# Altium schematic sheet CTR_USB.SchDoc: USB
size A4; DrawnBy: Andrei Divinagracia; Revision: 0A; SheetNumber: 9; SheetTotal: 10
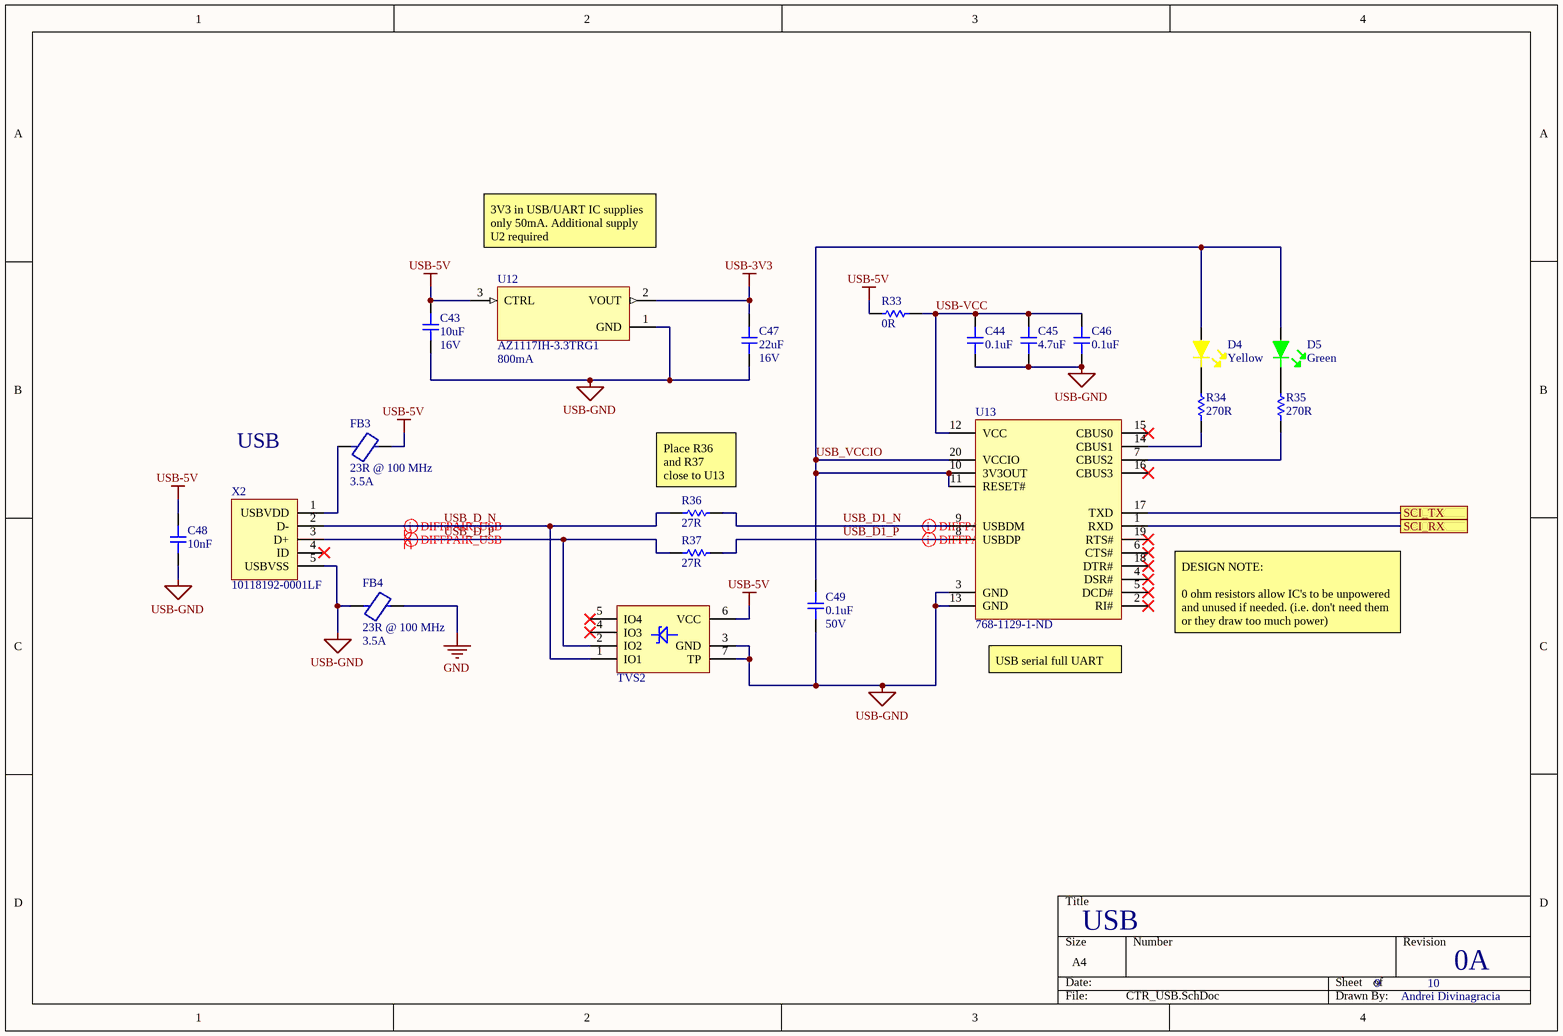
[diagram p0: CTR_USB.SchDoc]

## Parts
C43  10uF  Voltage: 16V  [CAP-0805]
C44  0.1uF  [CAP-0805]
C45  4.7uF  [CAP-1206]
C46  0.1uF  [CAP-0805]
C47  22uF  Voltage Rating: 16V  [CAP-0805]
C48  10nF  [CAP-0805]
C49  0.1uF  Voltage Rating: 50V  [CAP-0603]
D4  Yellow  [LED-0603]
D5  Green  [LED-0603]
FB3  23R @ 100 MHz  Max Current Rating: 3.5A  [FB-1806]
FB4  23R @ 100 MHz  Max Current Rating: 3.5A  [FB-1806]
R33  0R  [RES-0603]
R34  270R  [RES-0603]
R35  270R  [RES-0603]
R36  27R  [RES-0603]
R37  27R  [RES-0603]
TVS2  TVS-4-5.5V-Bi  [TVS-DRS-TP-5]  (value not drawn)
U12  AZ1117IH-3.3TRG1  Output Current: 800mA  [SOT223]
U13  768-1129-1-ND  [SSOP-20]
X2  10118192-0001LF  [USB_MICRO]

## Ports
SCI_RX, SCI_TX

## Nets
GND: FB4.2
USB-3V3: C47.2 U12.2(VOUT)
USB-5V: C43.2 C48.1 FB3.2 R33.2 TVS2.6(VCC) U12.3(CTRL)
USB-GND: C43.1 C44.1 C45.1 C46.1 C47.1 C48.2 C49.1 FB4.1 TVS2.3(GND) TVS2.7(TP) U12.1(GND) U13.3(GND) U13.13(GND) X2.5(USBVSS)
SCI_RX: U13.1(RXD) ; port SCI_RX
SCI_TX: U13.17(TXD) ; port SCI_TX
USB-VCC: C44.2 C45.2 C46.2 R33.1 U13.12(VCC)
USB_D1_N: R36.2 U13.9(USBDM)
USB_D1_P: R37.2 U13.8(USBDP)
USB_D_N: R36.1 TVS2.1(IO1) X2.2(D-)
USB_D_P: R37.1 TVS2.2(IO2) X2.3(D+)
USB_VCCIO: C49.2 D4.1 D5.1 U13.10(3V3OUT) U13.11(RESET#) U13.20(VCCIO)
NetD4_2: D4.2 R34.2
NetD5_2: D5.2 R35.2
NetFB3_1: FB3.1 X2.1(USBVDD)
NetR34_1: R34.1 U13.14(CBUS1)
NetR35_1: R35.1 U13.7(CBUS2)

Not connected (* = marked no-connect by the designer): TVS2 4(IO3)* 5(IO4)*; U13 2(RI#)* 4(DSR#)* 5(DCD#)* 6(CTS#)* 15(CBUS0)* 16(CBUS3)* 18(DTR#)* 19(RTS#)*; X2 4(ID)*

## Layout directives
differential pair: USB_D1_N, USB_D1_P, USB_D_N, USB_D_P

## Notes on the sheet
- (near U12) 3V3 in USB/UART IC supplies only 50mA. Additional supply U2 required
- USB
- (near R36) Place R36 and R37 close to U13
- (near U13) DESIGN NOTE:
  0 ohm resistors allow IC's to be unpowered and unused if needed. (i.e. don't need them or they draw too much power)
- (near U13) USB serial full UART

## Library data of the parts
C43 = 0805-10uF-16V: CAP CER 10UF 16V X5R 0805; Manufacturer: Samsung; Manufacturer Part Number: CL21A106KOQNNNE; Tolerance: 10%; Dielectric: X7R; Supplier 1: Digi-Key; Stock 1: 258396; Pricing 1: 1=0.11, 10=0.084, 50=0.0458, 100=0.0375, 500=0.02676, 1000=0.02103 (USD); Mount: Surface Mount; Case/Package: 0805; Case Code (Metric): 2012; Case Code (Imperial): 0805; Min Operating Temperature: -55°C; Max Operating Temperature: 85°C; Package Quantity: 1; Packaging: Tape and Reel; Series: CL; Voltage Rating: 16V; Capacitance: 10uF; Voltage Rating (DC): 16V; Construction: Flat; Length: 2mm; Width: 0.049inch; Height: 1.25mm; Thickness: 0.055inch; Depth: 1.25mm; Radiation Hardening: No; RoHS Compliant: Yes; Lead Free: Lead Free; ComponentLink1URL: http://www.samsungsem.com/kr/support/product-search/mlcc/CL21A106KOQNNNE.jsp?src-supplier=Digi-Key; ComponentLink1Description: http://www.samsungsem.com/kr/support/product-search/mlcc/CL21A106KOQNNNE.jsp?src-supplier=Digi-Key; ComponentLink2URL: http://www1.futureelectronics.com/doc/SAMSUNG%20PASSIVE/CL05B104KQ5NNNC.pdf?src-supplier=Future+Electronics; ComponentLink2Description: http://www1.futureelectronics.com/doc/SAMSUNG%20PASSIVE/CL05B104KQ5NNNC.pdf?src-supplier=Future+Electronics; ComponentLink3URL: https://www.verical.com/server-webapp/html/getDatasheet?partID=358435&src-supplier=Verical; ComponentLink3Description: https://www.verical.com/server-webapp/html/getDatasheet?partID=358435&src-supplier=Verical; Supplier Part Number 1: 1276-1096-1-ND
C44 C46 = 0805-0.1uF-50V: CAP CER 0.1UF 50V Y5V 0805; Manufacturer: KEMET; Manufacturer Part Number: C0805C104Z5VACTU; Dielectric Material: Ceramic; Tolerance: 80%; Dissipation Factor: 5%; Capacitance: 100nF; Supplier 1: Digi-Key; Stock 1: 929243; Pricing 1: 1=0.1, 10=0.057, 100=0.0254, 500=0.01818, 1000=0.01428 (USD); Mount: Surface Mount,PCB; Case/Package: 0805; Number of Pins: 2; Case Code (Metric): 2012; Case Code (Imperial): 0805; Min Operating Temperature: -30°C; Max Operating Temperature: 85°C; Package Quantity: 1; Voltage Rating: 50V; Packaging: Tape and Reel; Voltage Rating (DC): 50V; Dielectric: Y5V; Termination: SMD/SMT; Voltage: 50V; Length: 2mm; Height: 0.9mm; Lead Pitch: 0.75mm; Width: 0.049inch; Thickness: 0.039inch; Depth: 1.25mm; Radiation Hardening: No; REACH SVHC: No SVHC; Lead Free: Lead Free; ComponentLink1URL: http://www.alliedelec.com/m/d/9bfe7773041ffe9d406e68bc7b377fdd.pdf?src-supplier=Allied+Electronics; ComponentLink1Description: http://www.alliedelec.com/m/d/9bfe7773041ffe9d406e68bc7b377fdd.pdf?src-supplier=Allied+Electronics; ComponentLink2URL: https://www.verical.com/server-webapp/html/getDatasheet?partID=37101&src-supplier=Verical; ComponentLink2Description: https://www.verical.com/server-webapp/html/getDatasheet?partID=37101&src-supplier=Verical; ComponentLink3URL: https://www.verical.com/server-webapp/html/getDatasheet?partID=321176&src-supplier=Verical; ComponentLink3Description: https://www.verical.com/server-webapp/html/getDatasheet?partID=321176&src-supplier=Verical; ComponentLink4URL: http://www.farnell.com/datasheets/2123124.pdf?src-supplier=Element14; ComponentLink4Description: http://www.farnell.com/datasheets/2123124.pdf?src-supplier=Element14; Supplier Part Number 1: 399-1177-6-ND
C45 = 1206-4.7uF-50V: CAP CER 4.7UF 50V X7R 1206; Manufacturer: TDK; Manufacturer Part Number: C3216X7R1H475K160AC; Dielectric Material: Ceramic; Tolerance: 10%; Supplier 1: Digi-Key; Stock 1: 117540; Pricing 1: 1=0.76, 10=0.535, 50=0.4042, 100=0.3521, 500=0.26082, 1000=0.2217 (USD); Mount: Surface Mount; Case/Package: 1206; Case Code (Metric): 3216; Case Code (Imperial): 1206; Weight: 0.000571oz; Min Operating Temperature: -55°C; Max Operating Temperature: 125°C; Capacitance: 4.7uF; Voltage Rating: 50V; Packaging: Tape and Reel; Voltage Rating (DC): 50V; Termination: SMD/SMT; Series: C; Package Quantity: 1; Dielectric: X7R; Resistor Type: Ceramic; Length: 3.2mm; Width: 0.063inch; Depth: 1.6mm; Thickness: 1.6mm; REACH SVHC: No SVHC; Lead Free: Lead Free; RoHS Compliant: Yes; ComponentLink1URL: https://product.tdk.com/info/en/catalog/datasheets/mlcc_commercial_general_en.pdf?src-supplier=Digi-Key; ComponentLink1Description: https://product.tdk.com/info/en/catalog/datasheets/mlcc_commercial_general_en.pdf?src-supplier=Digi-Key; ComponentLink2URL: http://www.mouser.com/ds/2/400/lcc_commercial_general_en-560200.pdf?src-supplier=Mouser; ComponentLink2Description: http://www.mouser.com/ds/2/400/lcc_commercial_general_en-560200.pdf?src-supplier=Mouser; ComponentLink3URL: http://product.tdk.com/capacitor/mlcc/en/documents/mlcc_commercial_general_en.pdf?src-supplier=Future+Electronics; ComponentLink3Description: http://product.tdk.com/capacitor/mlcc/en/documents/mlcc_commercial_general_en.pdf?src-supplier=Future+Electronics; Supplier Part Number 1: 445-8032-6-ND
C47 = 0805-22uF-16V: CAP CER 22UF 16V X5R 0805; Manufacturer: Samsung; Manufacturer Part Number: CL21A226KOQNNNE; Tolerance: 10%; Supplier 1: Digi-Key; Stock 1: 761343; Pricing 1: 1=0.37, 10=0.258, 50=0.1804, 100=0.1546, 500=0.11592, 1000=0.09789 (USD); Mount: Surface Mount; Case/Package: 0805; Case Code (Metric): 2012; Case Code (Imperial): 0805; Min Operating Temperature: -55°C; Max Operating Temperature: 85°C; Packaging: Tape and Reel; Capacitance: 22uF; Voltage Rating (DC): 16V; Length: 0.079inch; Width: 0.049inch; Thickness: 0.055inch; Lead Free: Lead Free; RoHS Compliant: Yes; ComponentLink1URL: http://www.samsungsem.com/kr/support/library/product-catalog/mlcc.jsp?src-supplier=Digi-Key; ComponentLink1Description: http://www.samsungsem.com/kr/support/library/product-catalog/mlcc.jsp?src-supplier=Digi-Key; Supplier Part Number 1: 1276-6526-6-ND
C48 = 0805-10nF-50V: CAP CER SMD 0805 .01UF X7R 5% 50V; Manufacturer: KEMET; Manufacturer Part Number: C0805C103J5RAC7210; Dielectric Material: Ceramic; Supplier 1: Digi-Key; Stock 1: 35151; Pricing 1: 1=0.11, 10=0.078, 100=0.0347, 500=0.0248, 1000=0.01948, 2500=0.01771, 5000=0.01629 (USD); Case/Package: 0805; Case Code (Imperial): 0805; Case Code (Metric): 2012; Min Operating Temperature: -55°C; Max Operating Temperature: 125°C; Tolerance: 5%; Packaging: Tape and Reel; Capacitance: 10nF; Package Quantity: 10000; Voltage Rating: 50V; Voltage Rating (DC): 50V; Dielectric: X7R; Termination: SMD/SMT; Length: 2mm; Lead Pitch: 0.75mm; Depth: 1.25mm; ComponentLink1URL: http://components.arrow.com/part/dataview/3450688S9650973N7429?src-supplier=Arrow; ComponentLink1Description: http://components.arrow.com/part/dataview/3450688S9650973N7429?src-supplier=Arrow; ComponentLink2URL: http://www.mouser.com/ds/2/212/KEM_C1002_X7R_SMD-1102033.pdf?src-supplier=Mouser; ComponentLink2Description: http://www.mouser.com/ds/2/212/KEM_C1002_X7R_SMD-1102033.pdf?src-supplier=Mouser; ComponentLink3URL: https://api.kemet.com/component-edge/download/datasheet/C0805C103J5RAC7210.pdf?src-supplier=Digi-Key; ComponentLink3Description: https://api.kemet.com/component-edge/download/datasheet/C0805C103J5RAC7210.pdf?src-supplier=Digi-Key; Supplier Part Number 1: 399-17616-6-ND
C49 = 0603-0.1uF-50V: CAP CER 0.1UF 50V X7R 0603; Manufacturer: Samsung; Manufacturer Part Number: CL10B104KB8NNNL; Capacitance: 100nF; Tolerance: 10%; Supplier 1: Digi-Key; Stock 1: 1355979; Pricing 1: 1=0.1, 10=0.03, 50=0.0164, 100=0.0134, 500=0.00958, 1000=0.00753, 2500=0.00684, 5000=0.0063 (USD); Mount: Surface Mount; Case/Package: 0603; Min Operating Temperature: -55°C; Max Operating Temperature: 125°C; Packaging: Tape and Reel; Package Quantity: 15000; Dielectric: X7R; Voltage Rating (DC): 50V; Series: CL; Construction: Flat; Length: 1.6mm; Width: 0.031inch; Height: 0.8mm; Thickness: 0.035inch; Depth: 0.8mm; Radiation Hardening: No; RoHS Compliant: Yes; ComponentLink1URL: https://www.verical.com/server-webapp/html/getDatasheet?partID=357523&src-supplier=Verical; ComponentLink1Description: https://www.verical.com/server-webapp/html/getDatasheet?partID=357523&src-supplier=Verical; ComponentLink2URL: https://media.digikey.com/pdf/Data%20Sheets/Samsung%20PDFs/CL_Series_MLCC_ds.pdf?src-supplier=Digi-Key; ComponentLink2Description: https://media.digikey.com/pdf/Data%20Sheets/Samsung%20PDFs/CL_Series_MLCC_ds.pdf?src-supplier=Digi-Key; Supplier Part Number 1: 1276-CL10B104KB8NNNLCT-ND
D4 = LED-YELLOW: LED YELLOW CLEAR 0603 SMD; Manufacturer: Wurth Electronics; Manufacturer Part Number: 150060YS75000; Viewing Angle: 140°; Lens Style: Clear,Rectangular; Wavelength: 590nm; Luminous Intensity: 120mcd; Forward Voltage: 2V; Forward Current: 30mA; Test Current: 20mA; Supplier 1: Digi-Key; Stock 1: 129164; Pricing 1: 1=0.14, 50=0.133, 100=0.114, 500=0.099 (USD); Mount: Surface Mount; Case/Package: 0603; Case Code (Metric): 1608; Case Code (Imperial): 0603; Color: Yellow; Min Operating Temperature: -40°C; Max Operating Temperature: 85°C; Package Quantity: 4000; Packaging: Tape and Reel; Dominant Wavelength: 590nm; Length: 1.6mm; Width: 0.8mm; Height: 0.7mm; REACH SVHC: Unknown; RoHS Compliant: Yes; ComponentLink1URL: http://www.farnell.com/datasheets/1911348.pdf?src-supplier=Element14; ComponentLink1Description: http://www.farnell.com/datasheets/1911348.pdf?src-supplier=Element14; ComponentLink2URL: https://www.distrelec.biz/Web/Downloads/_t/ds/150060YS75000_eng_tds.pdf?mime=application%2Fpdf&src-supplier=Distrelec; ComponentLink2Description: https://www.distrelec.biz/Web/Downloads/_t/ds/150060YS75000_eng_tds.pdf?mime=application%2Fpdf&src-supplier=Distrelec; ComponentLink3URL: https://katalog.we-online.de/led/datasheet/150060YS75000.pdf?src-supplier=Digi-Key; ComponentLink3Description: https://katalog.we-online.de/led/datasheet/150060YS75000.pdf?src-supplier=Digi-Key; ComponentLink4URL: http://katalog.we-online.de/led/datasheet/150060YS75000.pdf?src-supplier=Newark; ComponentLink4Description: http://katalog.we-online.de/led/datasheet/150060YS75000.pdf?src-supplier=Newark; ComponentLink5URL: http://www.produktinfo.conrad.com/datenblaetter/750000-774999/759432-da-01-en-CHIPLED_0603_W_KL_GELB_150060YS75000.pdf?src-supplier=Conrad; ComponentLink5Description: http://www.produktinfo.conrad.com/datenblaetter/750000-774999/759432-da-01-en-CHIPLED_0603_W_KL_GELB_150060YS75000.pdf?src-supplier=Conrad; Supplier Part Number 1: 732-4981-1-ND
D5 = LED-Green: LED GREEN CLEAR 0603 SMD; Manufacturer: Wurth Electronics; Manufacturer Part Number: 150060VS75000; Luminous Intensity: 40mcd; Viewing Angle: 140°; Forward Voltage: 2V; Wavelength: 570nm; Lens Style: Clear,Rectangular; Forward Current: 30mA; Test Current: 20mA; Supplier 1: Digi-Key; Stock 1: 118118; Pricing 1: 1=0.14, 50=0.133, 100=0.114, 500=0.099 (USD); Mount: Surface Mount; Case/Package: 0603; Number of Pins: 2; Color: Green; Case Code (Metric): 1608; Case Code (Imperial): 0603; Min Operating Temperature: -40°C; Max Operating Temperature: 85°C; Package Quantity: 1; Packaging: Tape and Reel; Dominant Wavelength: 570nm; Length: 1.6mm; Height: 0.7mm; Width: 0.8mm; REACH SVHC: Unknown; ComponentLink1URL: https://katalog.we-online.de/led/datasheet/150060VS75000.pdf?src-supplier=Digi-Key; ComponentLink1Description: https://katalog.we-online.de/led/datasheet/150060VS75000.pdf?src-supplier=Digi-Key; Supplier Part Number 1: 732-4980-1-ND
FB3 FB4 = FERR-3A5: FERRITE BEAD 23 OHM 1806 1LN; Manufacturer: Taiyo Yuden; Manufacturer Part Number: FBMJ4516HL230NTV; Resistance: 180623R; Tolerance: 30%; Number of Lines: 1; DC Resistance (DCR): 14mR; Test Frequency: 100MHz; Supplier 1: Digi-Key; Stock 1: 1819; Pricing 1: 1=0.26, 10=0.202, 25=0.1676, 50=0.1444, 100=0.1299, 250=0.1097, 500=0.0982, 1000=0.0837 (USD); Mount: Surface Mount; Case/Package: 1806; Core Material: Ferrite; Case Code (Metric): 4516; Case Code (Imperial): 1806; Min Operating Temperature: -40°C; Max Operating Temperature: 125°C; Impedance: 23R; Package Quantity: 2000; Packaging: Tape and Reel; Max DC Current: 3.5A; Termination: SMD/SMT; Length: 0.177inch; Height: 1.1mm; Width: 1.6mm; Depth: 1.6mm; ComponentLink1URL: http://www.mouser.com/ds/2/396/chipbeads01_e-559265.pdf; ComponentLink1Description: http://www.mouser.com/ds/2/396/chipbeads01_e-559265.pdf; ComponentLink2URL: http://ds.yuden.co.jp/TYCOMPAS/ut/detail.do?productNo=FBMJ4516HL230NTV&fileName=FBMJ4516HL230NTV_SS&mode=specSheetDownload; ComponentLink2Description: http://ds.yuden.co.jp/TYCOMPAS/ut/detail.do?productNo=FBMJ4516HL230NTV&fileName=FBMJ4516HL230NTV_SS&mode=specSheetDownload; ComponentLink3URL: https://www.yuden.co.jp/ut/product/category/emisuppression/FBMJ4516HL230NTV_SS.pdf; ComponentLink3Description: https://www.yuden.co.jp/ut/product/category/emisuppression/FBMJ4516HL230NTV_SS.pdf; Supplier Part Number 1: 587-3857-1-ND
R33 = 0603-0R: RES SMD 0 OHM JUMPER 1/10W 0603; Manufacturer: Yageo; Manufacturer Part Number: RC0603JR-070RL; Resistance: 0mR; Tolerance: 1%; Voltage Rating: 50V; Power Rating: 100mW; Temperature Coefficient: 200ppm/°C; Supplier 1: Digi-Key; Stock 1: 25658294; Pricing 1: 1=0.1, 10=0.019, 25=0.0136, 50=0.0104, 100=0.0077, 250=0.00588, 500=0.00472, 1000=0.00347 (USD); Case/Package: 0603; Number of Pins: 2; Case Code (Imperial): 0603; Case Code (Metric): 1608; Contact Plating: Tin,Matte; Min Operating Temperature: -55°C; Max Operating Temperature: 155°C; Package Quantity: 5000; Packaging: Tape and Reel; Voltage Rating (DC): 50V; Termination: SMD/SMT; Composition: Thick Film; Military Standard: Not; Length: 1.6mm; Height: 0.45mm; Width: 0.8mm; Depth: 0.8mm; Radiation Hardening: No; REACH SVHC: No SVHC; Lead Free: Lead Free; ComponentLink1URL: http://www.farnell.com/datasheets/2167052.pdf?src-supplier=Element14; ComponentLink1Description: http://www.farnell.com/datasheets/2167052.pdf?src-supplier=Element14; ComponentLink2URL: https://www.verical.com/server-webapp/html/getDatasheet?partID=329462&src-supplier=Verical; ComponentLink2Description: https://www.verical.com/server-webapp/html/getDatasheet?partID=329462&src-supplier=Verical; ComponentLink3URL: http://www.yageo.com/documents/recent/PYu-RC_Group_51_RoHS_L_9.pdf?src-supplier=Mouser; ComponentLink3Description: http://www.yageo.com/documents/recent/PYu-RC_Group_51_RoHS_L_9.pdf?src-supplier=Mouser; ComponentLink4URL: http://www.farnell.com/datasheets/443971.pdf?src-supplier=Element14; ComponentLink4Description: http://www.farnell.com/datasheets/443971.pdf?src-supplier=Element14; ComponentLink5URL: http://documents.rs-components.com/techlib://itc_doclist_GB.htm?stockno=6515918&src-supplier=RSComponents; ComponentLink5Description: http://documents.rs-components.com/techlib://itc_doclist_GB.htm?stockno=6515918&src-supplier=RSComponents; Supplier Part Number 1: 311-0.0GRCT-ND
R34 R35 = 0603-270R: RES SMD 270 OHM 0.5% 1/10W 0603; Manufacturer: Yageo; Manufacturer Part Number: RT0603DRE07270RL; Voltage Rating: 75V; Power Rating: 100mW; Temperature Coefficient: 50ppm/°C; Voltage Rating (DC): 50V; Supplier 1: Digi-Key; Stock 1: 5811; Pricing 1: 1=0.1, 10=0.092, 100=0.0352, 1000=0.01549, 2500=0.01338 (USD); Case/Package: 0603; Case Code (Metric): 1608; Case Code (Imperial): 0603; Min Operating Temperature: -55°C; Max Operating Temperature: 155°C; Resistance: 270R; Tolerance: 0.5%; Packaging: Tape and Reel; Package Quantity: 5000; Termination: SMD/SMT; Resistor Type: Thin Film; Number of Terminations: 2; Max Power Dissipation: 100mW; Features: Moisture Resistant; Series: RT; Length: 0.063inch; Width: 0.031inch; Height: 0.022inch; Lead Free: Lead Free; RoHS Compliant: Yes; ComponentLink1URL: http://www.yageo.com/NewPortal/yageodocoutput?fileName=/pdf/R-Chip/PYu-RT_1-to-0.05_RoHS_L_5.pdf&src-supplier=Digi-Key; ComponentLink1Description: http://www.yageo.com/NewPortal/yageodocoutput?fileName=/pdf/R-Chip/PYu-RT_1-to-0.05_RoHS_L_5.pdf&src-supplier=Digi-Key; Supplier Part Number 1: 311-2504-1-ND
R36 R37 = 0603-27R: RES SMD 27 OHM 5% 1/10W 0603; Manufacturer: Panasonic; Manufacturer Part Number: ERJ-3GEYJ270V; Power Rating: 100mW; Voltage Rating: 75V; Temperature Coefficient: 200ppm/°C; Voltage Rating (DC): 50V; Supplier 1: Digi-Key; Stock 1: 20003; Pricing 1: 1=0.1, 10=0.037, 100=0.0151, 1000=0.0068, 2500=0.0059 (USD); Mount: Surface Mount; Case/Package: 0603; Case Code (Metric): 1608; Case Code (Imperial): 0603; Contact Plating: Tin; Weight: 7.1E-05oz; Min Operating Temperature: -55°C; Max Operating Temperature: 155°C; Resistance: 27R; Tolerance: 5%; Packaging: Tape and Reel; Package Quantity: 5000; Resistor Type: Thick Film; Number of Terminations: 2; Termination: SMD/SMT; Max Power Dissipation: 100mW; Features: Automotive AEC-Q200; Series: ERJ; Resistance Tolerance: 5%; Construction: Rectangular; Technology: THICK FILM; Length: 1.6mm; Width: 0.031inch; Height: 0.45mm; Depth: 0.8mm; Radiation Hardening: No; REACH SVHC: No SVHC; Military Standard: Not; Lead Free: Lead Free; RoHS Compliant: Yes; ComponentLink1URL: http://www.jameco.com/Jameco/Products/ProdDS/1988663.pdf?src-supplier=Jameco; ComponentLink1Description: http://www.jameco.com/Jameco/Products/ProdDS/1988663.pdf?src-supplier=Jameco; ComponentLink2URL: http://www.farnell.com/datasheets/1500035.pdf?src-supplier=Element14; ComponentLink2Description: http://www.farnell.com/datasheets/1500035.pdf?src-supplier=Element14; ComponentLink3URL: http://www.farnell.com/datasheets/1678796.pdf?src-supplier=Element14; ComponentLink3Description: http://www.farnell.com/datasheets/1678796.pdf?src-supplier=Element14; ComponentLink4URL: https://www.alliedelec.com/m/d/51cd0790071e1666bdb9d00c57fcf960.pdf?src-supplier=Allied+Electronics; ComponentLink4Description: https://www.alliedelec.com/m/d/51cd0790071e1666bdb9d00c57fcf960.pdf?src-supplier=Allied+Electronics; ComponentLink5URL: http://industrial.panasonic.com/www-data/pdf/AOA0000/AOA0000CE1.pdf?src-supplier=Avnet; ComponentLink5Description: http://industrial.panasonic.com/www-data/pdf/AOA0000/AOA0000CE1.pdf?src-supplier=Avnet; Supplier Part Number 1: P27GCT-ND
TVS2 = TVS-4-5.5V-Bi: TVS DIODE 5.5V 6SON; Manufacturer: Texas Instruments; Manufacturer Part Number: TPD4E001DRSR; Direction: Unidirectional; Capacitance: 1.5pF; Number of Channels: 4; Min Breakdown Voltage: 11V; Peak Pulse Power: 100W; Power Line Protection: Yes; Clamping Voltage: 105.5V; Leakage Current: 1nA; Test Current: 10mA; Peak Pulse Current: 5.5A; Interface: LVDS,USB,Ethernet; Supplier 1: Digi-Key; Stock 1: 16747; Pricing 1: 1=0.67, 10=0.576, 100=0.4304, 500=0.33814 (USD); Number of Pins: 6; Min Operating Temperature: -40°C; Max Operating Temperature: 85°C; Packaging: Tape and Reel; Package Quantity: 1000; Operating Supply Voltage: 5.5V; Number of Bidirectional Channels: 4; Reverse Standoff Voltage: 5.5V; Termination: SMD/SMT; Working Voltage: 5.5V; Max Power Dissipation: 100W; ESD Protection: Yes; Max Reverse Leakage Current: 1nA; Length: 3mm; Width: 3.15mm; Height: 0.75mm; Depth: 3mm; Radiation Hardening: No; REACH SVHC: No SVHC; Lead Free: Lead Free; ComponentLink1URL: http://www.ti.com/lit/ds/symlink/tpd4e001.pdf?src-supplier=Digi-Key; ComponentLink1Description: http://www.ti.com/lit/ds/symlink/tpd4e001.pdf?src-supplier=Digi-Key; ComponentLink2URL: https://www.verical.com/server-webapp/html/getDatasheet?partID=143410&src-supplier=Verical; ComponentLink2Description: https://www.verical.com/server-webapp/html/getDatasheet?partID=143410&src-supplier=Verical; ComponentLink3URL: http://focus.ti.com/lit/ds/symlink/tpd4e001.pdf?src-supplier=Avnet+Europe; ComponentLink3Description: http://focus.ti.com/lit/ds/symlink/tpd4e001.pdf?src-supplier=Avnet+Europe; Supplier Part Number 1: 296-22852-1-ND
U12 = AZ1117IH-3.3TRG1: IC REG LINEAR 3.3V 1A SOT223; Manufacturer: Diodes; Dropout Voltage: 1.2V; Number of Regulators: 1; Supplier 1: Digi-Key; Stock 1: 96644; Pricing 1: 1=0.38, 10=0.305, 25=0.2796, 100=0.2079, 250=0.18844, 500=0.15594, 1000=0.11696 (USD); Mount: Surface Mount; Case/Package: TO-261-4; Number of Pins: 3; Min Operating Temperature: -40°C; Max Operating Temperature: 125°C; Packaging: Tape and Reel; Output Voltage: 3.3V; Min Current Limit: 1A; RoHS Compliant: Yes; ComponentLink1URL: https://www.diodes.com/assets/Datasheets/AZ1117I.pdf?src-supplier=Digi-Key; ComponentLink1Description: https://www.diodes.com/assets/Datasheets/AZ1117I.pdf?src-supplier=Digi-Key; Supplier Part Number 1: AZ1117IH-3.3TRG1DICT-ND; Manufacturer Part Number: AZ1117IH-3.3TRG1
U13 = FT231XS-R: IC USB SERIAL FULL UART 20SSOP; Manufacturer: FTDI; Number of Channels: 1; Max Supply Voltage: 5.5V; Min Supply Voltage: 2.97V; Operating Supply Voltage: 5V; Data Rate: 12Mbps; Interface: UART,USB; Operating Supply Current: 8mA; Supplier 1: Digi-Key; Manufacturer Part Number: FT231XS-R; Stock 1: 54093; Pricing 1: 1=2.22, 25=2.15, 100=2.08, 250=1.88, 500=1.7, 1000=1.675 (USD); Mount: Surface Mount; Case/Package: SSOP; Number of Pins: 20; Weight: 0.016oz; Min Operating Temperature: -40°C; Max Operating Temperature: 85°C; Packaging: Tape and Reel; Package Quantity: 2000; Series: USBmadeEZ-UART, FT-X, X-Chip; Length: 8.74mm; Width: 0.157inch; Height: 0.059inch; Radiation Hardening: No; RoHS Compliant: Yes; ComponentLink1URL: http://www.alliedelec.com/images/products/datasheets/bm/FTDI/70403932.pdf?src-supplier=Allied+Electronics; ComponentLink1Description: http://www.alliedelec.com/images/products/datasheets/bm/FTDI/70403932.pdf?src-supplier=Allied+Electronics; ComponentLink2URL: http://uk.rs-online.com/webdocs/1102/0900766b811020d3.pdf?src-supplier=RSComponents; ComponentLink2Description: http://uk.rs-online.com/webdocs/1102/0900766b811020d3.pdf?src-supplier=RSComponents; ComponentLink3URL: https://media.digikey.com/pdf/Data%20Sheets/FTDI%20Chip%20PDFs/X-Chip_Series_Errata.pdf?src-supplier=Digi-Key; ComponentLink3Description: https://media.digikey.com/pdf/Data%20Sheets/FTDI%20Chip%20PDFs/X-Chip_Series_Errata.pdf?src-supplier=Digi-Key; ComponentLink4URL: http://www.ftdichip.com/Support/Documents/DataSheets/ICs/DS_FT231X.pdf?src-supplier=Digi-Key; ComponentLink4Description: http://www.ftdichip.com/Support/Documents/DataSheets/ICs/DS_FT231X.pdf?src-supplier=Digi-Key; Supplier Part Number 1: 768-1129-1-ND
X2 = CONN-USB: CONN_USB - micro B USB 2.0 Receptacle Connector 5 Position Surface Mount, Right Angle, Horizontal; Manufacturer: Amphenol FCI; Current Rating: 1.8A; Connector Type: USB,Receptacle; Number of Contacts: 5; Insulation Resistance: 1GR; Number of Ports: 1; Max Voltage Rating (AC): 100V; USB Standard: USB 2.0; Pitch: 0.65mm; Supplier 1: Digi-Key; Manufacturer Part Number: 10118192-0001LF; Stock 1: 197826; Pricing 1: 1=0.46, 10=0.437, 25=0.3744, 50=0.318, 100=0.3056, 250=0.2744, 500=0.262 (USD); Mount: Surface Mount,Horizontal; Contact Material: Copper Alloy; Contact Plating: Nickel,Gold; Number of Terminals: 5; Housing Material: Polymer; Colour: Black; Min Operating Temperature: -55°C; Max Operating Temperature: 85°C; Packaging: Tape and Reel; Package Quantity: 1400; Gender: Receptacle; Termination: Solder; Voltage Rating: 100V; Orientation: Right Angle; Length: 7.86mm; Depth: 5.57mm; Radiation Hardening: No; REACH SVHC: No SVHC; Lead Free: Lead Free; Flammability Rating: UL94 V-0; ComponentLink1URL: https://datasheet.ciiva.com/26853/getdatasheetpartid-418041-26853891.pdf; ComponentLink1Description: https://datasheet.ciiva.com/26853/getdatasheetpartid-418041-26853891.pdf; ComponentLink2URL: https://datasheet.ciiva.com/851/10118192-851112.pdf; ComponentLink2Description: https://datasheet.ciiva.com/851/10118192-851112.pdf; ComponentLink3URL: https://datasheet.ciiva.com/4598/10118192ac-197249-4598796.pdf; ComponentLink3Description: https://datasheet.ciiva.com/4598/10118192ac-197249-4598796.pdf; Supplier Part Number 1: 609-4613-1-ND